# EAGLE design EMI_Detect_V1.1 (EAGLE 7.6.0)
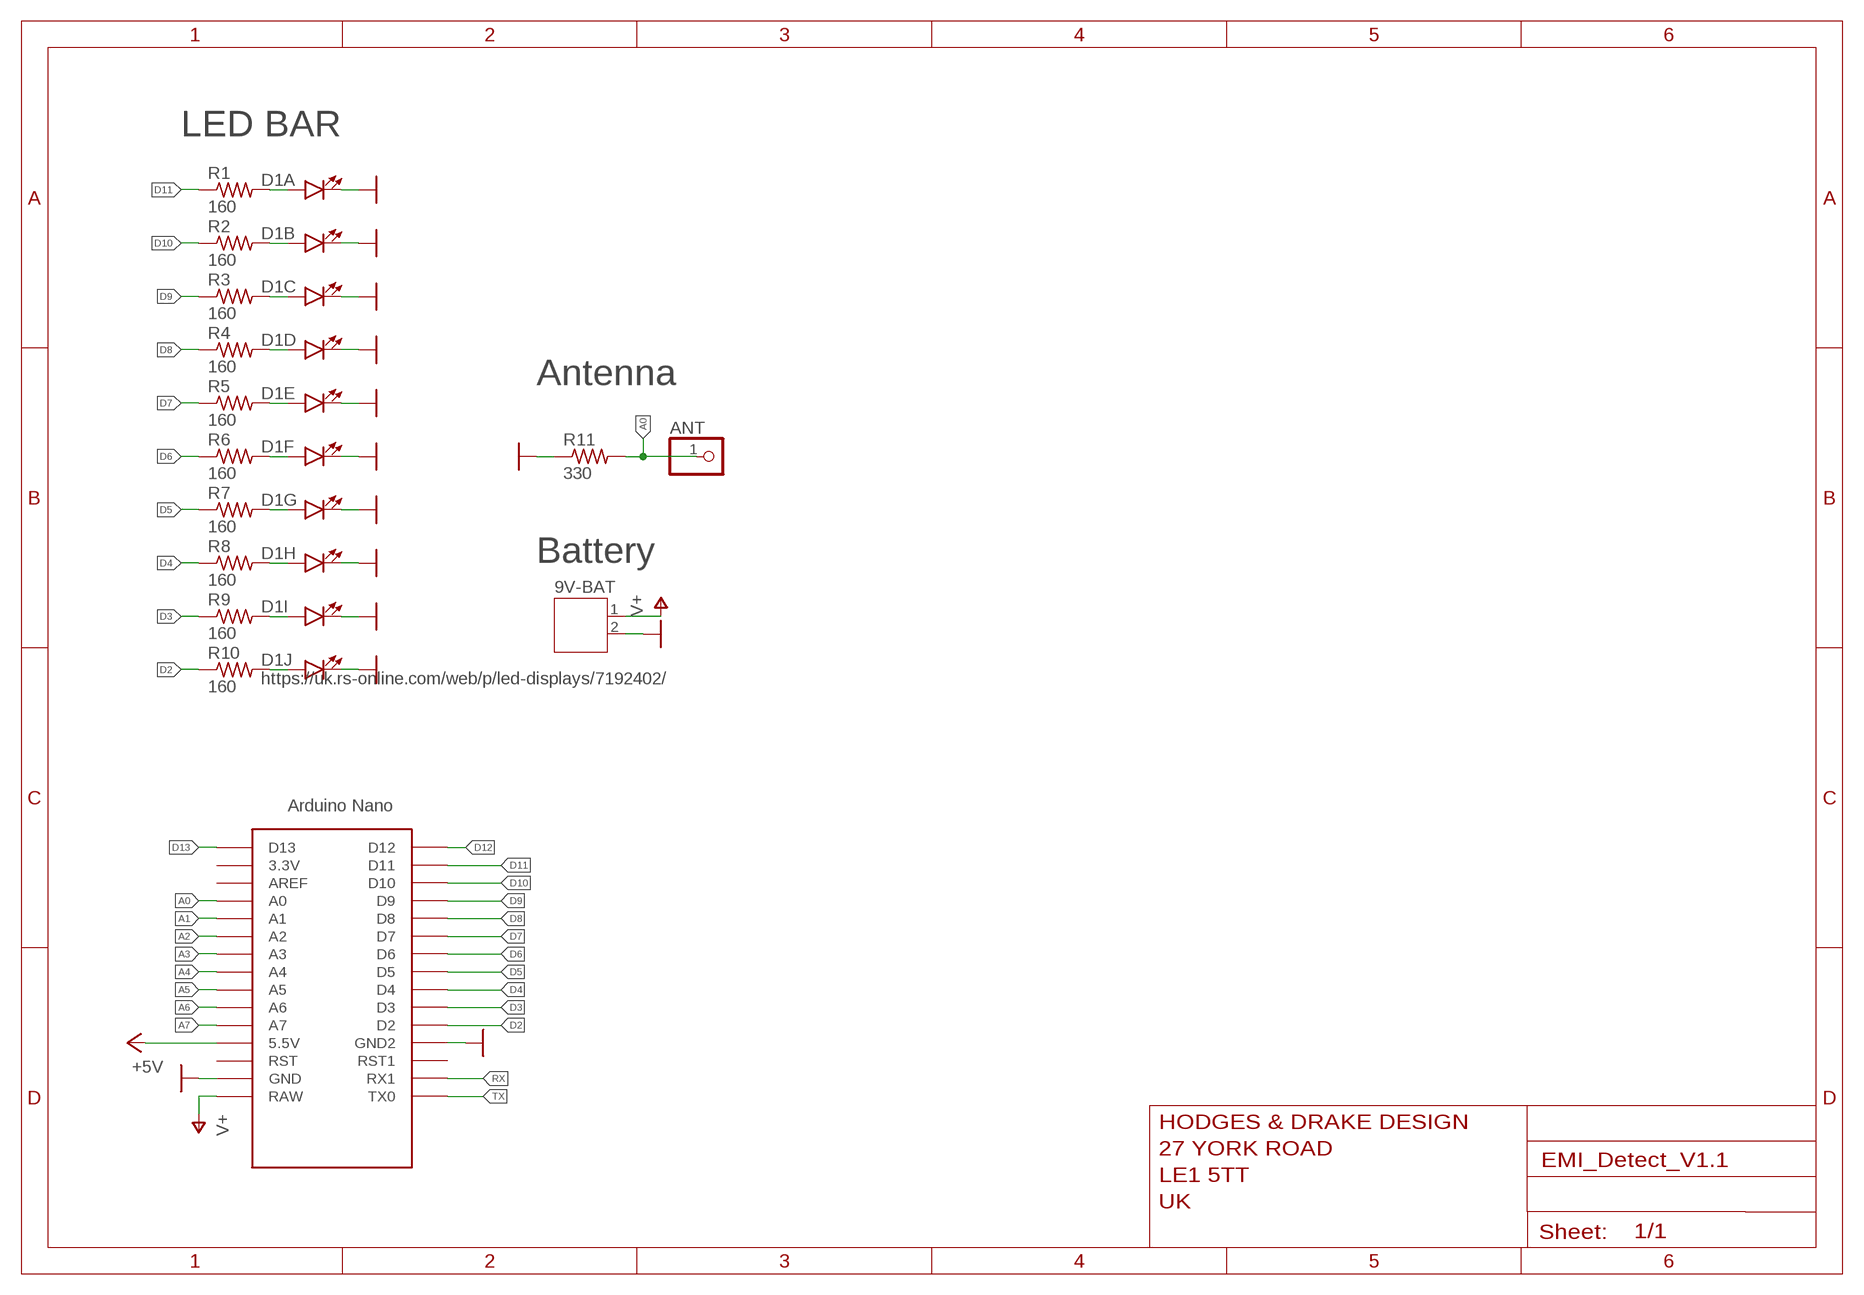
[diagram p0: schematic, sheet 1]

## Parts
9V-BAT  JST-PH2  [JST-PH2-S2B]
ANT  PINHD-1X1  [1X01]
D1  https://uk.rs-online.com/web/p/led-displays/7192402/  LED_BARGRAPH_10  [LED_BARGAPH_10]
R1  160  R-US_R0603  [R0603]
R2  160  R-US_R0603  [R0603]
R3  160  R-US_R0603  [R0603]
R4  160  R-US_R0603  [R0603]
R5  160  R-US_R0603  [R0603]
R6  160  R-US_R0603  [R0603]
R7  160  R-US_R0603  [R0603]
R8  160  R-US_R0603  [R0603]
R9  160  R-US_R0603  [R0603]
R10  160  R-US_R0603  [R0603]
R11  330  R-US_R0603  [R0603]
U1  NANO  [NANO]

## Nets
+5V: U1.5V(5.5V)
A0: ANT.1 R11.2 U1.A0
A1: U1.A1
A2: U1.A2
A3: U1.A3
A4: U1.A4
A5: U1.A5
A6: U1.A6
A7: U1.A7
D2: R10.1 U1.D2
D3: R9.1 U1.D3
D4: R8.1 U1.D4
D5: R7.1 U1.D5
D6: R6.1 U1.D6
D7: R5.1 U1.D7
D8: R4.1 U1.D8
D9: R3.1 U1.D9
D10: R2.1 U1.D10
D11: R1.1 U1.D11
D12: U1.D12
D13: U1.D13
GND: 9V-BAT.2 D1.11(J:C) D1.12(I:C) D1.13(H:C) D1.14(G:C) D1.15(F:C) D1.16(E:C) D1.17(D:C) D1.18(C:C) D1.19(B:C) D1.20(A:C) R11.1 U1.GND U1.GND1(GND2)
N$1: D1.1(A:A) R1.2
N$2: D1.2(B:A) R2.2
N$3: D1.3(C:A) R3.2
N$4: D1.4(D:A) R4.2
N$5: D1.5(E:A) R5.2
N$6: D1.6(F:A) R6.2
N$7: D1.7(G:A) R7.2
N$8: D1.8(H:A) R8.2
N$9: D1.9(I:A) R9.2
N$10: D1.10(J:A) R10.2
RX: U1.RX1
TX: U1.TX0
V+: 9V-BAT.1 U1.RAW
Unconnected: U1.3.3V U1.AREF U1.ICSP1 U1.ICSP2 U1.ICSP3 U1.ICSP4 U1.ICSP5 U1.ICSP6 U1.RST U1.RST1

## Notes on the sheet
- LED BAR
- Antenna
- Battery

## Library data of the parts
9V-BAT = con-jst-ph:JST-PH2
ANT = adafruit:PINHD-1X1: Pin header 1x1 for 0.1" spacing With round pins
D1 = SparkFun-LED:LED_BARGRAPH_10: 10-Segment LED Bar Graph SFE part numbers: COM-09935 (red, Vf = 2.1V, Ifmax = 20mA) COM-09936 (yellow, Vf = 2.1V, Ifmax = 20mA) COM-09937 (blue, Vf = 3.4V, Ifmax = 20mA) COM-09938 (green, Vf = 3.4V, Ifmax = 20mA)
R1-R11 = rcl:R-US_: RESISTOR, American symbol
U1 = Arduino-clone:NANO: Arduino Nano

## Board
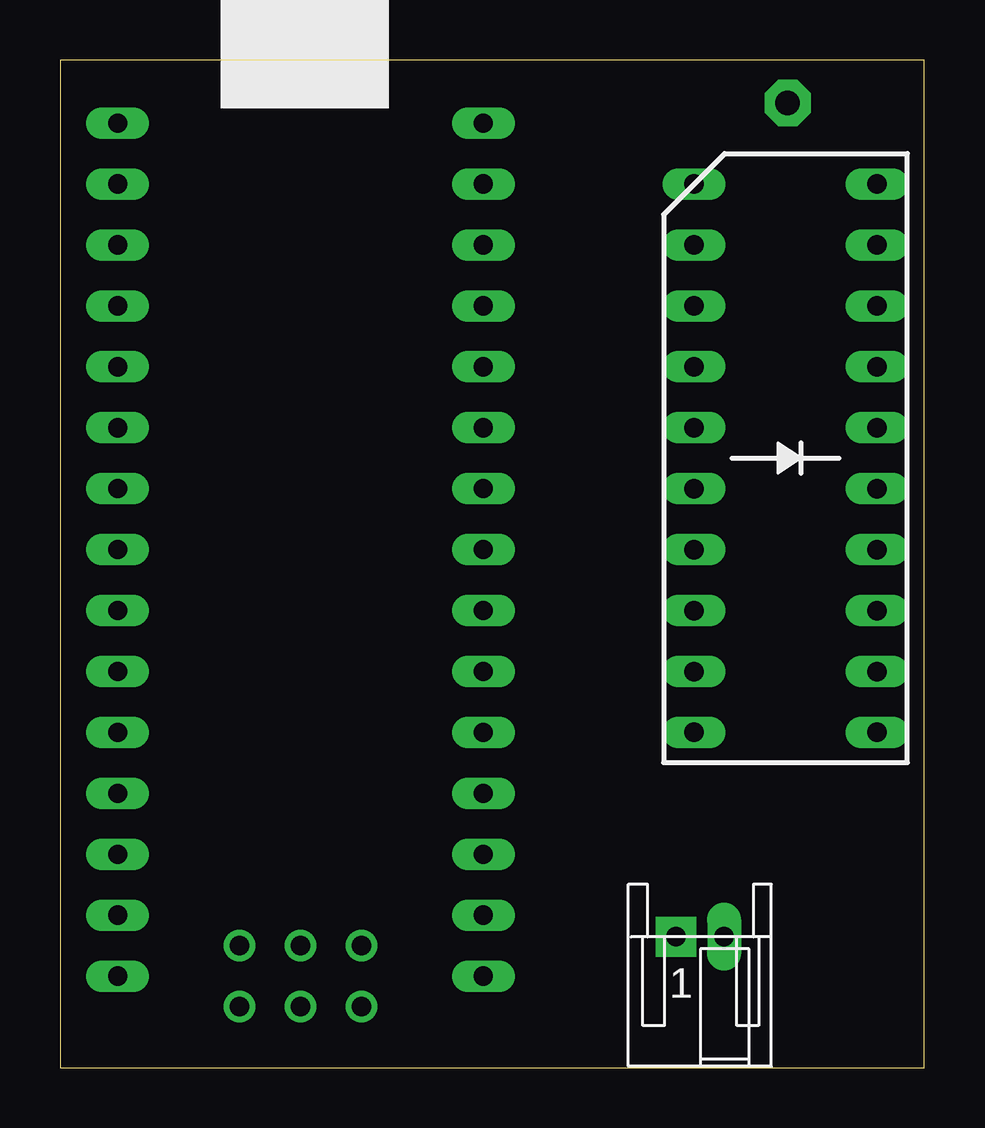
[diagram p1: board, top side]
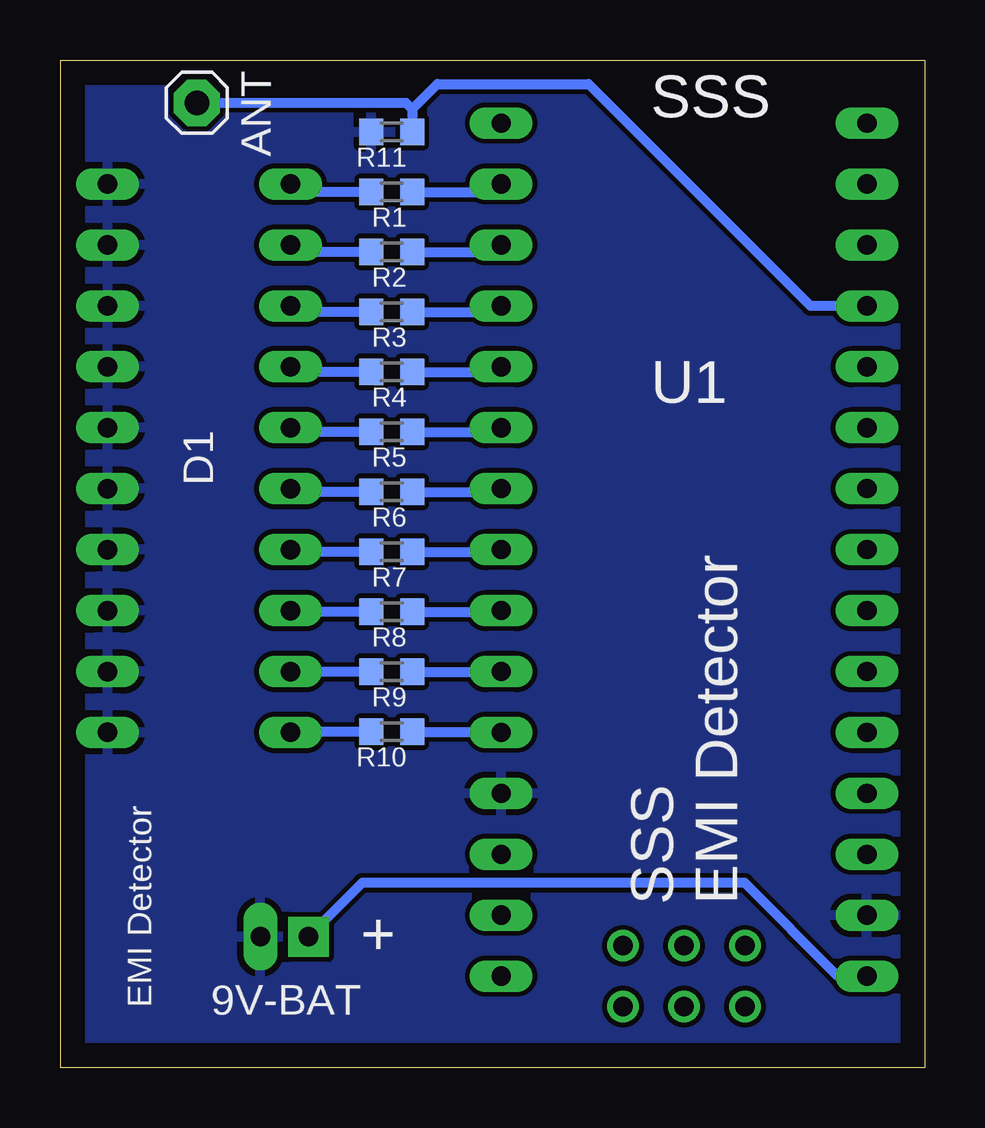
[diagram p2: board, bottom side, seen from below]

Size 36 x 42 mm. Coordinates in mm from the lower left corner, seen from the top.
Outline: 0,0 36,0 36,42 0,42 0,0
Copper layers (1*16): Top 0.035mm / dielectric 1.5mm / Bottom 0.035mm
Design rules "default": minimum track width 10mil, minimum drill 24mil, track to track 8mil, track to pad 8mil, pad to pad 8mil, via to via 8mil, smd to smd 8mil, copper to edge 40mil, drill to drill 8mil, minimum pad ring 10mil, minimum via ring 8mil, stop-mask expansion 4mil, vias tented up to drill 0mil, thermal gap 10mil

### Footprints (pad centres in the part's own frame; a part is rotated, then mirrored left to right if it is on the bottom)
JST-PH2-S2B = drill 0.813 pad 1.676 square: 1 -1.977,2.169 | drill 0.813 pad 1.422 long: 2 -3.977,2.169
1X01 = drill 1.016 pad 1.93 octagon: 1 0,0
LED_BARGAPH_10 = drill 0.813 long: 1 -11.43,-3.81; 2 -8.89,-3.81; 3 -6.35,-3.81; 4 -3.81,-3.81; 5 -1.27,-3.81; 6 1.27,-3.81; 7 3.81,-3.81; 8 6.35,-3.81; 9 8.89,-3.81; 10 11.43,-3.81; 11 11.43,3.81; 12 8.89,3.81; 13 6.35,3.81; 14 3.81,3.81; 15 1.27,3.81; 16 -1.27,3.81; 17 -3.81,3.81; 18 -6.35,3.81; 19 -8.89,3.81; 20 -11.43,3.81
R0603 = smd 1 x 1.1: 1 -0.85,0; 2 0.85,0
NANO = drill 0.8 long: 3.3V -10.16,24.13; 5V -10.16,-1.27; A0 -10.16,19.05; A1 -10.16,16.51; A2 -10.16,13.97; A3 -10.16,11.43; A4 -10.16,8.89; A5 -10.16,6.35; A6 -10.16,3.81; A7 -10.16,1.27; AREF -10.16,21.59; D2 5.08,1.27; D3 5.08,3.81; D4 5.08,6.35; D5 5.08,8.89; D6 5.08,11.43; D7 5.08,13.97; D8 5.08,16.51; D9 5.08,19.05; D10 5.08,21.59; D11 5.08,24.13; D12 5.08,26.67; D13 -10.16,26.67; GND -10.16,-6.35; GND1 5.08,-1.27; RAW -10.16,-8.89; RST -10.16,-3.81; RST1 5.08,-3.81; RX1 5.08,-6.35; TX0 5.08,-8.89 | drill 0.8: ICSP1 -5.08,-10.16; ICSP2 -5.08,-7.62; ICSP3 -2.54,-10.16; ICSP4 -2.54,-7.62; ICSP5 0,-10.16; ICSP6 0,-7.62

### Placement (x,y rotation side)
9V-BAT  23.69,7.62 180 top
ANT  30.32,40.21 270 bottom
D1  30.23,25.4 270 top
R1  22.2,36.5 180 bottom
R2  22.2,34 180 bottom
R3  22.2,31.5 180 bottom
R4  22.2,29 180 bottom
R5  22.2,26.5 180 bottom
R6  22.2,24 180 bottom
R7  22.2,21.5 180 bottom
R8  22.2,19 180 bottom
R9  22.2,16.5 180 bottom
R10  22.2,14 180 bottom
R11  22.2,39 0 bottom
U1  12.56,12.7 0 top

### Tracks (layer width: path | path; a pad name or v marks a point on that pad's centre or on a via)
A0
  Bottom 0.406: 21.35,39.95 R11.2 | U1.A0 4.75,31.75 14,41 20.3,41 21.35,39.95 | ANT.1 21.61,40.21 21.35,39.95
D2
  Bottom 0.406: R10.1 17.67,14 U1.D2
D3
  Bottom 0.406: R9.1 U1.D3
D4
  Bottom 0.406: R8.1 17.69,19 U1.D4
D5
  Bottom 0.406: R7.1 17.73,21.5 U1.D5
D6
  Bottom 0.406: R6.1 17.77,24 U1.D6
D7
  Bottom 0.406: R5.1 17.81,26.5 U1.D7
D8
  Bottom 0.406: R4.1 17.85,29 U1.D8
D9
  Bottom 0.406: R3.1 17.89,31.5 U1.D9
D10
  Bottom 0.406: R2.1 17.93,34 U1.D10
D11
  Bottom 0.406: R1.1 17.97,36.5 U1.D11
GND
  pour Bottom: 0,0 0,44 39,44 39,0
N$1
  Bottom 0.406: R1.2 26.09,36.5 D1.1
N$2
  Bottom 0.406: R2.2 26.13,34 D1.2
N$3
  Bottom 0.406: R3.2 26.17,31.5 D1.3
N$4
  Bottom 0.406: R4.2 26.21,29 D1.4
N$5
  Bottom 0.406: R5.2 26.25,26.5 D1.5
N$6
  Bottom 0.406: R6.2 26.29,24 D1.6
N$7
  Bottom 0.406: R7.2 26.33,21.5 D1.7
N$8
  Bottom 0.406: R8.2 26.37,19 D1.8
N$9
  Bottom 0.406: R9.2 D1.9
N$10
  Bottom 0.406: R10.2 26.39,14 D1.10
V+
  Bottom 0.406: U1.RAW 3.61,3.81 7.5,7.7 23.42,7.7 9V-BAT.1

### Text on the board
bPlace: SSS | U1 | SSS / EMI Detector | + | EMI Detector